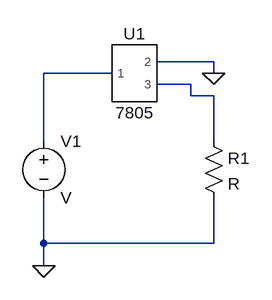
[diagram p0: schematic Draft1.asc]
Draft1.asc, the LTspice schematic file:
Version 4
SHEET 1 880 680
WIRE 304 96 224 96
WIRE 160 112 64 112
WIRE 304 112 304 96
WIRE 272 128 224 128
WIRE 272 144 272 128
WIRE 304 144 272 144
WIRE 64 208 64 112
WIRE 304 208 304 144
WIRE 64 352 64 288
WIRE 304 352 304 288
WIRE 304 352 64 352
WIRE 64 384 64 352
FLAG 304 112 0
FLAG 64 384 0
SYMBOL 7805 192 112 R0
SYMATTR InstName U1
SYMBOL voltage 64 192 R0
SYMATTR InstName V1
SYMBOL res 288 192 R0
SYMATTR InstName R1

The netlist it stands for:
* Draft1.asc
XU1 N001 0 N002 7805  ; pins 1 2 3
V1 N001 0 V
R1 N002 0 R
.lib C:\Users\srich\Downloads\IC7805 LTSpice netlist.cir
.backanno
.end